# EAGLE design GlobeCopterSensor (EAGLE 8.2.2)
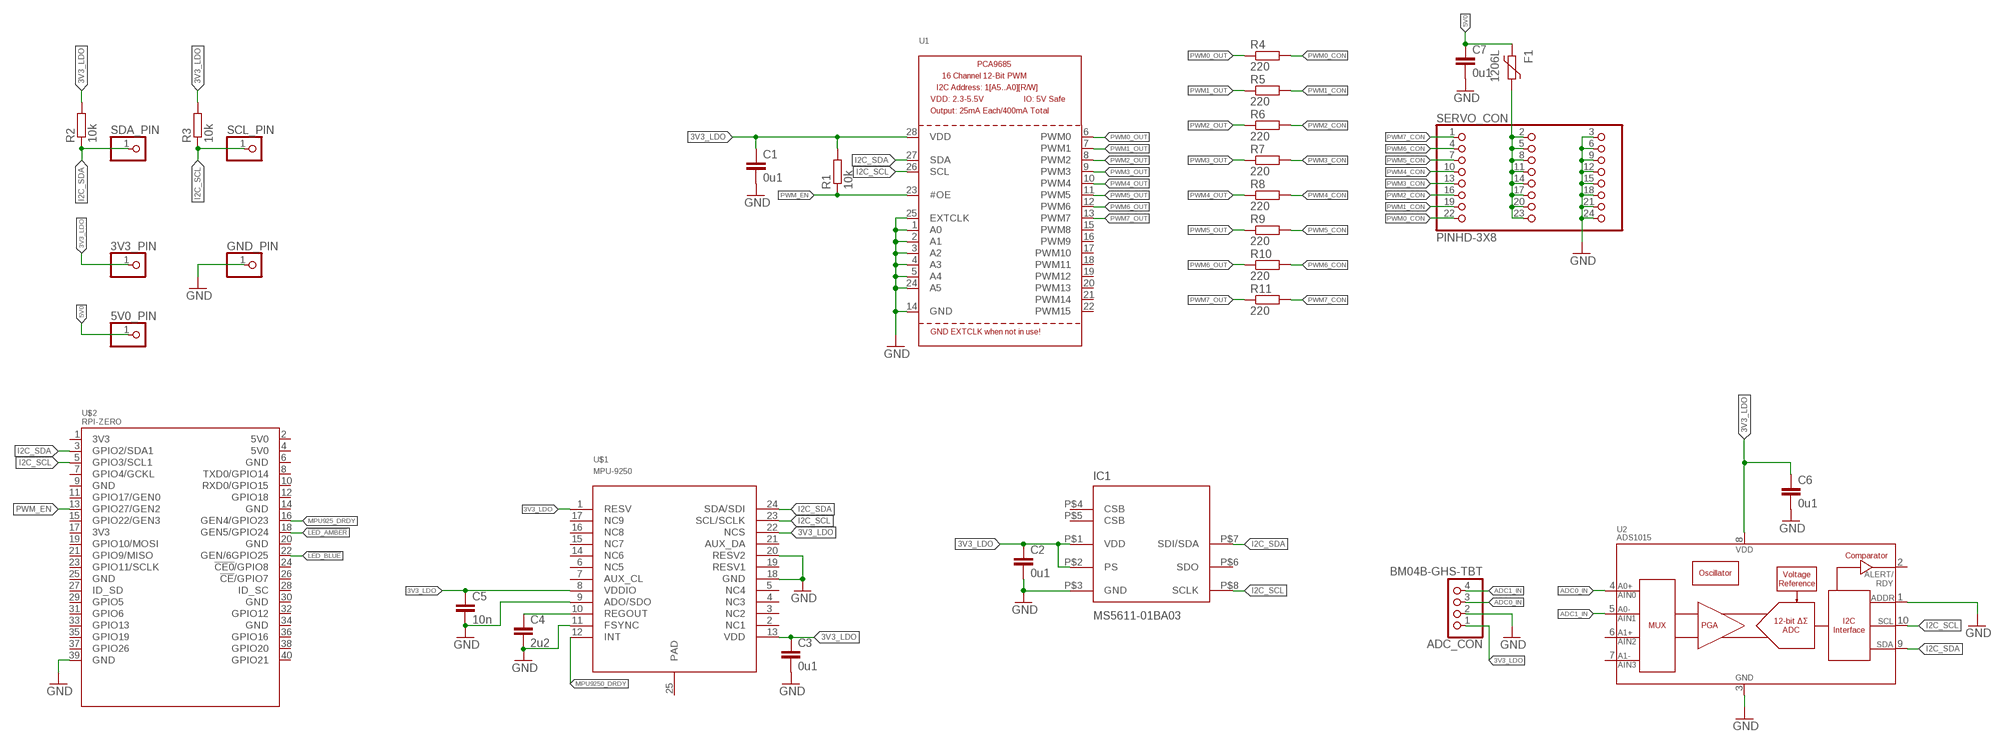
[diagram p0: schematic, sheet 1]

## Parts
3V3_PIN  PINHD-1X1  [1X01]
5V0_PIN  PINHD-1X1  [1X01]
ADC_CON  BM04B-GHS-TBT  [BM04B-GHS-TBT]
C1  0u1  C-EUC0603  [C0603]
C2  0u1  C-EUC0603  [C0603]
C3  0u1  C-EUC0603  [C0603]
C4  2u2  C-EUC0603  [C0603]
C5  10n  C-EUC0603  [C0603]
C6  0u1  C-EUC0603  [C0603]
C7  0u1  C-EUC0603  [C0603]
F1  1206L  [1206L]
GND_PIN  PINHD-1X1  [1X01]
IC1  MS5611-01BA03  [MS5611-01BA03]
R1  10k  R-EU_R0603  [R0603]
R2  10k  R-EU_R0603  [R0603]
R3  10k  R-EU_R0603  [R0603]
R4  220  R-EU_R0603  [R0603]
R5  220  R-EU_R0603  [R0603]
R6  220  R-EU_R0603  [R0603]
R7  220  R-EU_R0603  [R0603]
R8  220  R-EU_R0603  [R0603]
R9  220  R-EU_R0603  [R0603]
R10  220  R-EU_R0603  [R0603]
R11  220  R-EU_R0603  [R0603]
SCL_PIN  PINHD-1X1  [1X01]
SDA_PIN  PINHD-1X1  [1X01]
SERVO_CON  PINHD-3X8  [3X8]
U1  PCA9685  [TSSOP28]
U2  ADS1015  [MSOP10]
U$1  MPU-9250  [LEAD-QFN24]
U$2  RPI-ZERO  [RASPBERRYPI_BASTELSTUBE_V13_RASPI_BOARD_B+_FULL]

## Nets
3V3_LDO: 3V3_PIN.1 ADC_CON.1 C1.1 C2.1 C3.1 C5.1 C6.1 IC1.P$1(VDD) IC1.P$2(PS) R1.2 R2.2 R3.2 U1.28(VDD) U2.8(VDD) U$1.1(RESV) U$1.8(VDDIO) U$1.13(VDD) U$1.22(NCS)
5V0: 5V0_PIN.1 C7.1 F1.P$1
!LED_AMBER!: U$2.18(GEN5/GPIO24)
!LED_BLUE!: U$2.22(GEN/6GPIO25)
ADC0_IN: ADC_CON.3 U2.4(AIN0)
ADC1_IN: ADC_CON.4 U2.5(AIN1)
GND: ADC_CON.2 C1.2 C2.2 C3.2 C4.2 C5.2 C6.2 C7.2 GND_PIN.1 IC1.P$3(GND) SERVO_CON.3 SERVO_CON.6 SERVO_CON.9 SERVO_CON.12 SERVO_CON.15 SERVO_CON.18 SERVO_CON.21 SERVO_CON.24 U1.1(A0) U1.2(A1) U1.3(A2) U1.4(A3) U1.5(A4) U1.14(GND) U1.24(A5) U1.25(EXTCLK) U2.1(ADDR) U2.3(VSS) U$1.9(ADO/SDO) U$1.11(FSYNC) U$1.18(GND) U$1.20(RESV2) U$2.39(GND)
I2C_SCL: IC1.P$8(SCLK) R3.1 SCL_PIN.1 U1.26(SCL) U2.10(SCL) U$1.23(SCL/SCLK) U$2.5(GPIO3/SCL1)
I2C_SDA: IC1.P$7(SDI/SDA) R2.1 SDA_PIN.1 U1.27(SDA) U2.9(SDA) U$1.24(SDA/SDI) U$2.3(GPIO2/SDA1)
MPU925_DRDY: U$2.16(GEN4/GPIO23)
MPU9250_DRDY: U$1.12(INT)
N$2: C4.1 U$1.10(REGOUT)
N$3: F1.P$2 SERVO_CON.2 SERVO_CON.5 SERVO_CON.8 SERVO_CON.11 SERVO_CON.14 SERVO_CON.17 SERVO_CON.20 SERVO_CON.23
PWM0_CON: R4.2 SERVO_CON.22
PWM0_OUT: R4.1 U1.6(PWM0)
PWM1_CON: R5.2 SERVO_CON.19
PWM1_OUT: R5.1 U1.7(PWM1)
PWM2_CON: R6.2 SERVO_CON.16
PWM2_OUT: R6.1 U1.8(PWM2)
PWM3_CON: R7.2 SERVO_CON.13
PWM3_OUT: R7.1 U1.9(PWM3)
PWM4_CON: R8.2 SERVO_CON.10
PWM4_OUT: R8.1 U1.10(PWM4)
PWM5_CON: R9.2 SERVO_CON.7
PWM5_OUT: R9.1 U1.11(PWM5)
PWM6_CON: R10.2 SERVO_CON.4
PWM6_OUT: R10.1 U1.12(PWM6)
PWM7_CON: R11.2 SERVO_CON.1
PWM7_OUT: R11.1 U1.13(PWM7)
PWM_EN: R1.1 U1.23(#OE) U$2.13(GPIO27/GEN2)
Unconnected: IC1.P$4(CSB) IC1.P$5(CSB) IC1.P$6(SDO) U1.15(PWM8) U1.16(PWM9) U1.17(PWM10) U1.18(PWM11) U1.19(PWM12) U1.20(PWM13) U1.21(PWM14) U1.22(PWM15) U2.2(ALERT/RDY) U2.6(AIN2) U2.7(AIN3) U$1.2(NC1) U$1.3(NC2) U$1.4(NC3) U$1.5(NC4) U$1.6(NC5) U$1.7(AUX_CL) U$1.14(NC6) U$1.15(NC7) U$1.16(NC8) U$1.17(NC9) U$1.19(RESV1) U$1.21(AUX_DA) U$1.25(PAD) U$2.1(3V3) U$2.2(5V0) U$2.4(5V0) U$2.6(GND) U$2.7(GPIO4/GCKL) U$2.8(TXD0/GPIO14) U$2.9(GND) U$2.10(RXD0/GPIO15) U$2.11(GPIO17/GEN0) U$2.12(GPIO18) U$2.14(GND) U$2.15(GPIO22/GEN3) U$2.17(3V3) U$2.19(GPIO10/MOSI) U$2.20(GND) U$2.21(GPIO9/MISO) U$2.23(GPIO11/SCLK) U$2.24(!CE0!/GPIO8) U$2.25(GND) U$2.26(!CE!/GPIO7) U$2.27(ID_SD) U$2.28(ID_SC) U$2.29(GPIO5) U$2.30(GND) U$2.31(GPIO6) U$2.32(GPIO12) U$2.33(GPIO13) U$2.34(GND) U$2.35(GPIO19) U$2.36(GPIO16) U$2.37(GPIO26) U$2.38(GPIO20) U$2.40(GPIO21)

## Library data of the parts
3V3_PIN 5V0_PIN GND_PIN SCL_PIN SDA_PIN = pinhead:PINHD-1X1: PIN HEADER
ADC_CON = connector:BM04B-GHS-TBT
C1-C7 = resistor:C-EU: CAPACITOR, European symbol
F1 = ptc-littlefuse:1206L
IC1 = Measurement-Specialties:MS5611-01BA03: Variometer Module, with stainless steel cap
R1-R11 = resistor:R-EU_: RESISTOR, European symbol
SERVO_CON = pinhead:PINHD-3X8
U1 = adafruit:PCA9685: PCA9685 - 16 Channel 12-Bit I2C PWM Controller 5.0V tolerant 16 channel, 12-bit I2C PWM controller with 25mA per output (max. 400mA total) Digikey: 568-5931-1-ND
U2 = SparkFun-AnalogIC:ADS1015: 12-Bit Del-Sig ADC Four single-ended inputs or two differential inputs Internal PGA I2C interface 2.0-5.5V; PROD_ID: IC-12239
U$1 = invensense:MPU-9250
U$2 = RPI-Zero:RPI-ZERO

## Board
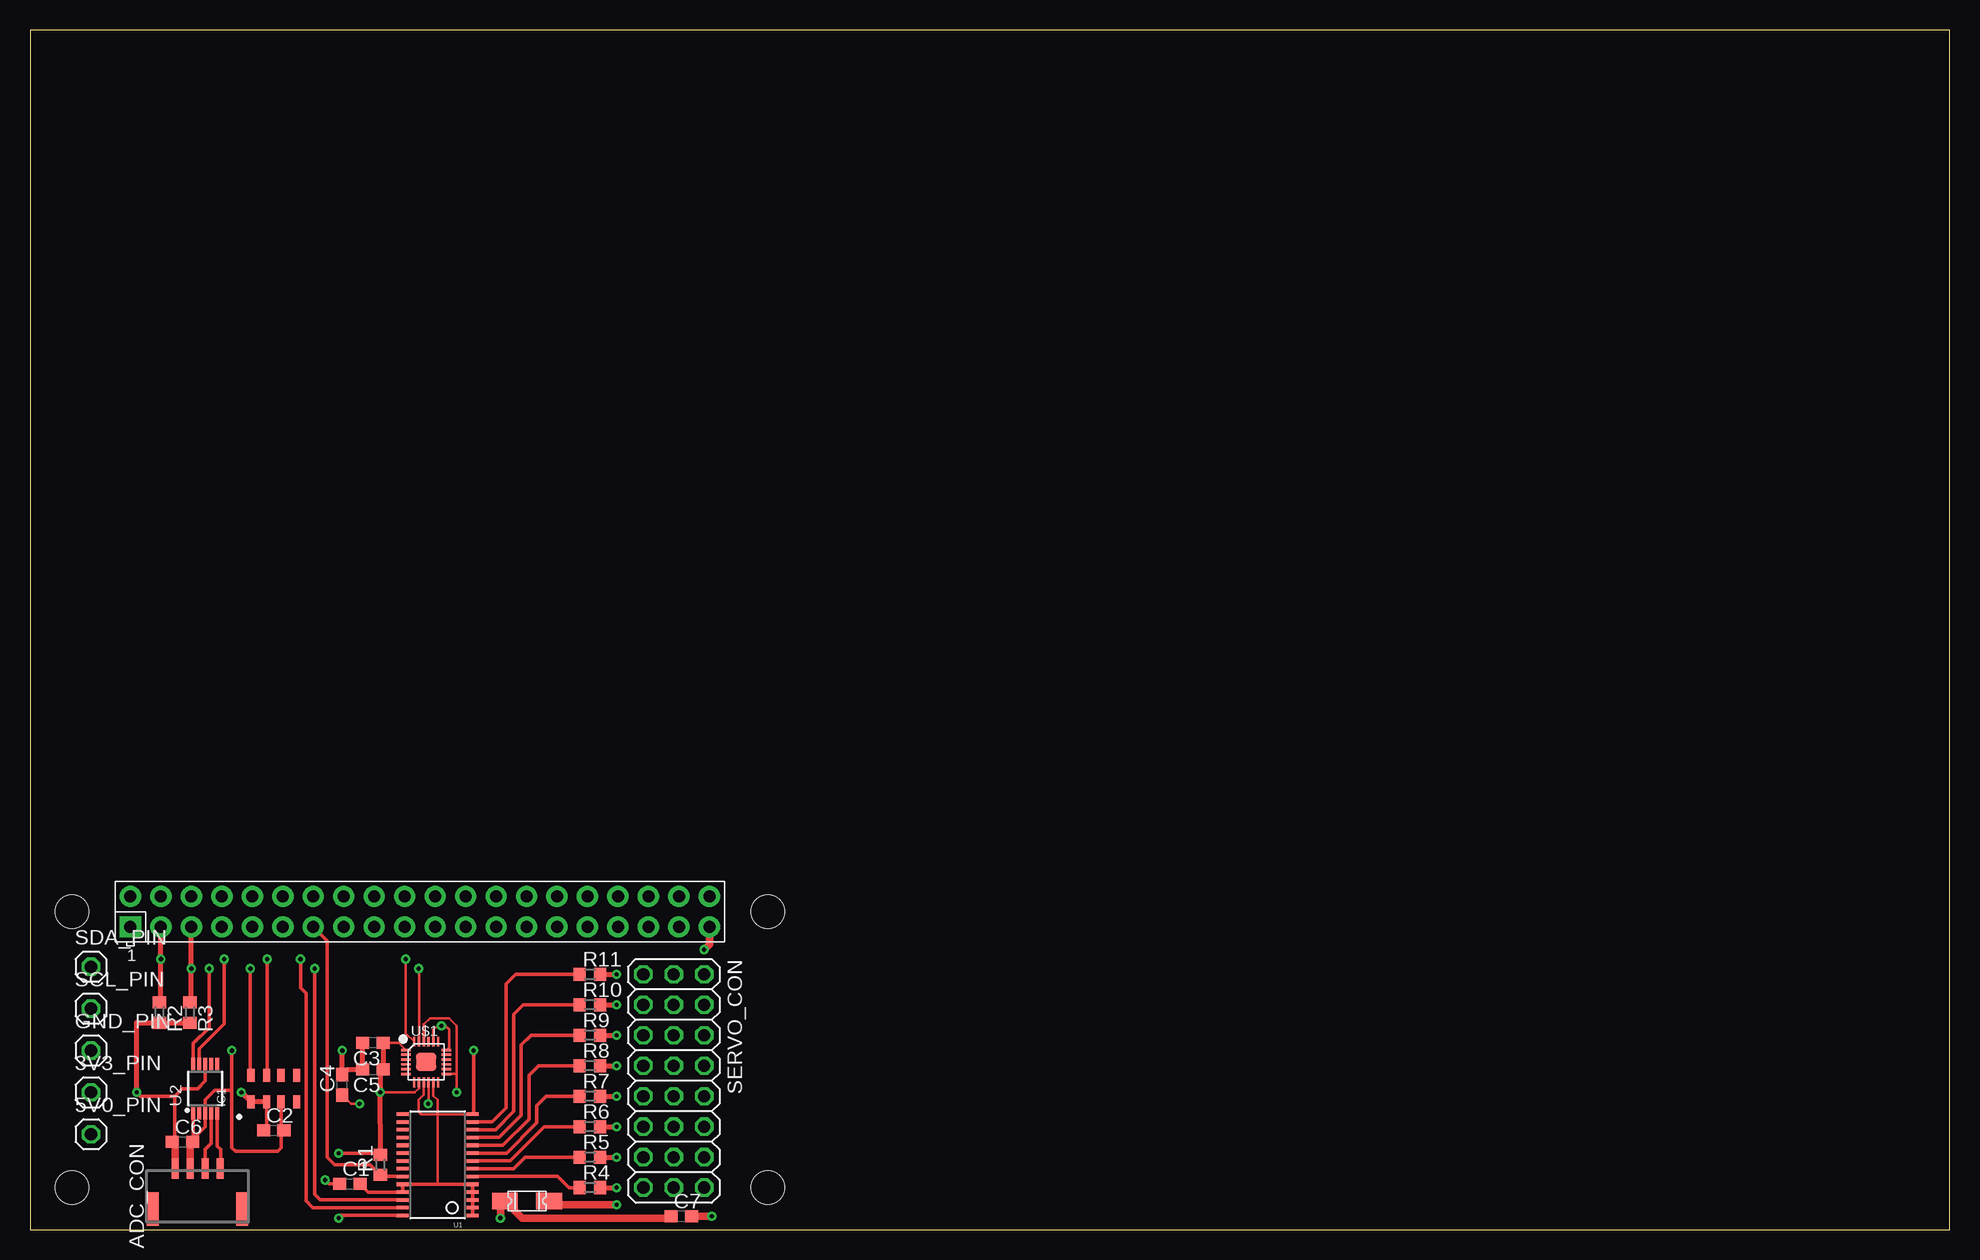
[diagram p1: board, top side]
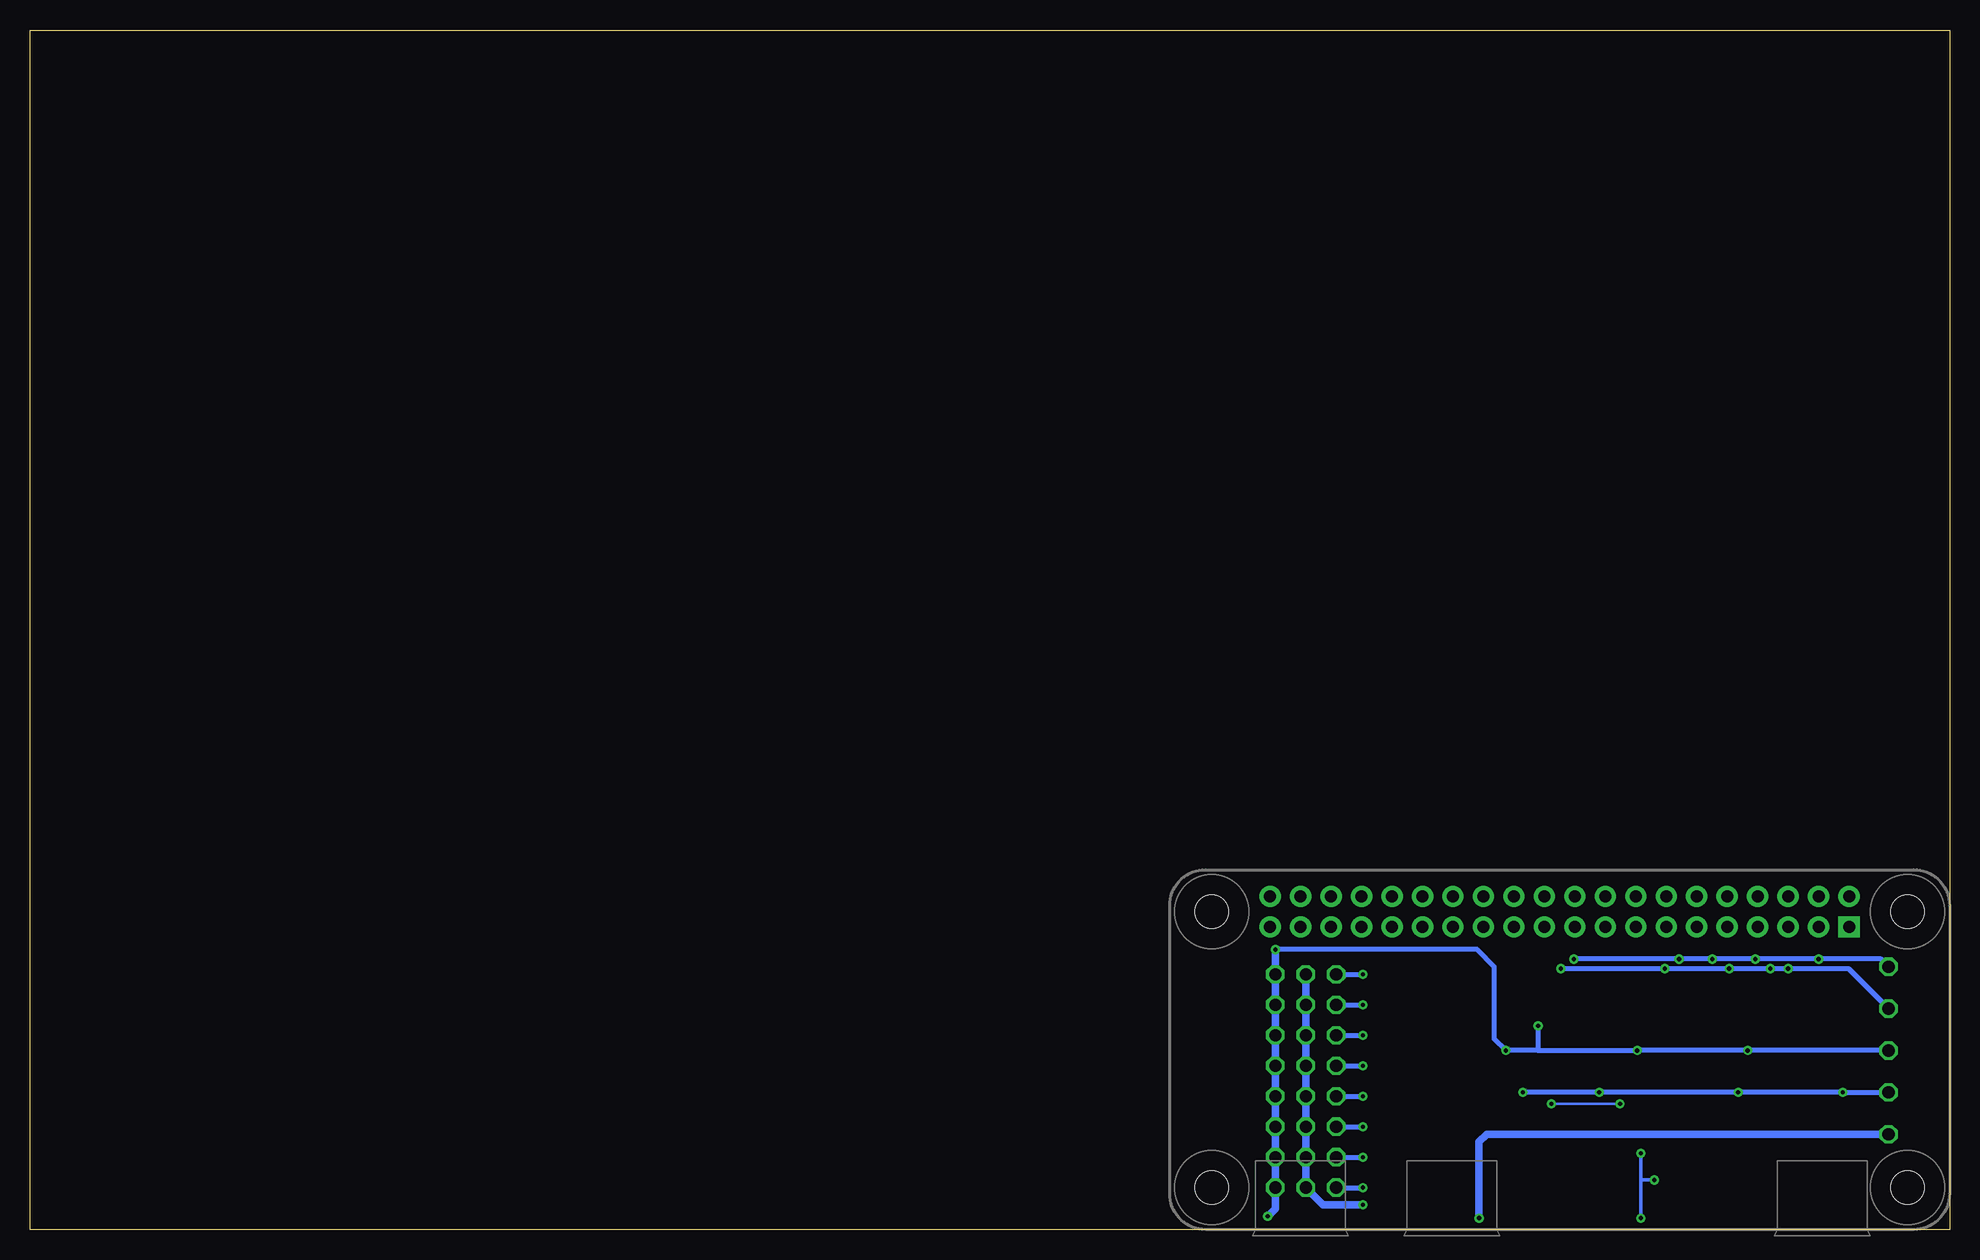
[diagram p2: board, bottom side, seen from below]

Size 160 x 100 mm. Coordinates in mm from the lower left corner, seen from the top.
Outline: 0,0 160,0 160,100 0,100 0,0
Copper layers (1*16): Top 0.035mm / dielectric 1.5mm / Bottom 0.035mm
Design rules "default": minimum track width 6mil, minimum drill 0.35mm, track to track 6mil, track to pad 6mil, pad to pad 6mil, via to via 6mil, smd to smd 6mil, copper to edge 40mil, drill to drill 6mil, minimum pad ring 10mil, minimum via ring 8mil, stop-mask expansion 4mil, vias tented up to drill 0mil, thermal gap 10mil

### Footprints (pad centres in the part's own frame; a part is rotated, then mirrored left to right if it is on the bottom)
1X01 = drill 1.016 octagon: 1 0,0
BM04B-GHS-TBT = smd 0.6 x 1.7: 1 -1.875,2.21; 2 -0.625,2.21; 3 0.625,2.21; 4 1.875,2.21 | smd 1 x 2.8: FIT@1 -3.725,-1.14; FIT@2 3.725,-1.14
C0603 = smd 1.1 x 1: 1 -0.85,0; 2 0.85,0
1206L = smd 2.16 x 1.4: P$1 -1.85,0; P$2 1.85,0
MS5611-01BA03 = smd 1.1 x 0.6: P$1 -1.1,1.9; P$2 -1.1,0.6; P$3 -1.11,-0.6; P$4 -1.1,-1.9; P$5 1.1,-1.9; P$6 1.1,-0.6; P$7 1.1,0.6; P$8 1.1,1.9
R0603 = smd 1 x 1.1: 1 -0.85,0; 2 0.85,0
3X8 = drill 1.016 octagon: 1 -8.89,0; 2 -8.89,2.54; 3 -8.89,5.08; 4 -6.35,0; 5 -6.35,2.54; 6 -6.35,5.08; 7 -3.81,0; 8 -3.81,2.54; 9 -3.81,5.08; 10 -1.27,0; 11 -1.27,2.54; 12 -1.27,5.08; 13 1.27,0; 14 1.27,2.54; 15 1.27,5.08; 16 3.81,0; 17 3.81,2.54; 18 3.81,5.08; 19 6.35,0; 20 6.35,2.54; 21 6.35,5.08; 22 8.89,0; 23 8.89,2.54; 24 8.89,5.08
TSSOP28 = smd 0.305 x 0.991: 1 -4.225,-2.918; 2 -3.575,-2.918; 3 -2.925,-2.918; 4 -2.275,-2.918; 5 -1.625,-2.918; 6 -0.975,-2.918; 7 -0.325,-2.918; 8 0.325,-2.918; 9 0.975,-2.918; 10 1.625,-2.918; 11 2.275,-2.918; 12 2.925,-2.918; 13 3.575,-2.918; 14 4.225,-2.918; 15 4.225,2.918; 16 3.575,2.918; 17 2.925,2.918; 18 2.275,2.918; 19 1.625,2.918; 20 0.975,2.918; 21 0.325,2.918; 22 -0.325,2.918; 23 -0.975,2.918; 24 -1.625,2.918; 25 -2.275,2.918; 26 -2.925,2.918; 27 -3.575,2.918; 28 -4.225,2.918
MSOP10 = smd 0.3 x 1: 1 -1,-2.05; 2 -0.5,-2.05; 3 0,-2.05; 4 0.5,-2.05; 5 1,-2.05; 6 1,2.05; 7 0.5,2.05; 8 0,2.05; 9 -0.5,2.05; 10 -1,2.05
LEAD-QFN24 = smd 0.8 x 0.2: 1 -1.7,1; 2 -1.7,0.6; 3 -1.7,0.2; 4 -1.7,-0.2; 5 -1.7,-0.6; 6 -1.7,-1; 13 1.7,-1; 14 1.7,-0.6; 15 1.7,-0.2; 16 1.7,0.2; 17 1.7,0.6; 18 1.7,1 | smd 0.2 x 0.8: 7 -1,-1.7; 8 -0.6,-1.7; 9 -0.2,-1.7; 10 0.2,-1.7; 11 0.6,-1.7; 12 1,-1.7; 19 1,1.7; 20 0.6,1.7; 21 0.2,1.7; 22 -0.2,1.7; 23 -0.6,1.7; 24 -1,1.7 | smd 1.7 x 1.54: 25 0,0
RASPBERRYPI_BASTELSTUBE_V13_RASPI_BOARD_B+_FULL = drill 1 pad 1.778 square: 1 8.37,25.23 | drill 1 pad 1.778: 2 8.37,27.77; 3 10.91,25.23; 4 10.91,27.77; 5 13.45,25.23; 6 13.45,27.77; 7 15.99,25.23; 8 15.99,27.77; 9 18.53,25.23; 10 18.53,27.77; 11 21.07,25.23; 12 21.07,27.77; 13 23.61,25.23; 14 23.61,27.77; 15 26.15,25.23; 16 26.15,27.77; 17 28.69,25.23; 18 28.69,27.77; 19 31.23,25.23; 20 31.23,27.77; 21 33.77,25.23; 22 33.77,27.77; 23 36.31,25.23; 24 36.31,27.77; 25 38.85,25.23; 26 38.85,27.77; 27 41.39,25.23; 28 41.39,27.77; 29 43.93,25.23; 30 43.93,27.77; 31 46.47,25.23; 32 46.47,27.77; 33 49.01,25.23; 34 49.01,27.77; 35 51.55,25.23; 36 51.55,27.77; 37 54.09,25.23; 38 54.09,27.77; 39 56.63,25.23; 40 56.63,27.77 | hole 2.75: 3.5,3.5; 3.5,26.5; 61.5,3.5; 61.5,26.5

### Placement (x,y rotation side)
3V3_PIN  5.08,11.43 0 top
5V0_PIN  5.08,7.94 0 top
ADC_CON  13.97,2.86 0 top
C1  26.67,3.81 0 top
C2  20.32,8.26 0 top
C3  28.57,15.56 180 top
C4  26.04,12.06 90 top
C5  28.57,13.34 180 top
C6  12.7,7.3 0 top
C7  54.29,1.11 0 top
F1  41.43,2.38 0 top
GND_PIN  5.08,14.92 0 top
IC1  20.32,11.75 90 top
R1  29.21,5.4 90 top
R2  10.79,18.1 270 top
R3  13.34,18.1 270 top
R4  46.67,3.49 0 top
R5  46.67,6.03 0 top
R6  46.67,8.57 0 top
R7  46.67,11.11 0 top
R8  46.67,13.65 0 top
R9  46.67,16.19 0 top
R10  46.67,18.73 0 top
R11  46.67,21.27 0 top
SCL_PIN  5.08,18.41 0 top
SDA_PIN  5.08,21.91 0 top
SERVO_CON  51.12,12.38 270 top
U1  33.97,5.4 90 top
U2  14.61,11.75 0 top
U$1  33.02,13.97 0 top
U$2  0,0 0 top

### Tracks (layer width: path | path; a pad name or v marks a point on that pad's centre or on a via)
3V3_LDO  (via drill 0.35)
  Top 0.203: U$1.22 32.82,17.1 33.34,17.62 34.92,17.62 35.56,16.99 35.56,12.96 | U$1.8 32.42,11.78 32.07,11.43 v29.2,11.43 | U$1.1 30.73,15.56 C3.1 | 35.56,12.96 35.55,12.97 U$1.13 | 35.56,12.96 v35.56,11.43
  Top 0.305: U2.8 14.61,12.38 13.97,11.75 12.7,11.75 12.06,11.11 | 12.06,11.11 12.06,7.52 C6.1 | v8.89,11.43 9.21,11.11 12.06,11.11 | IC1.P$2 19.72,8.26 C2.1 | 29.21,13.12 C5.1 | U1.28 25.94,1.17 v25.72,0.95 | v25.72,6.35 29.11,6.35 R1.2 | C1.1 24.92,3.81 v24.61,4.13
  Top 0.406: C3.1 C5.1 29.2,13.11 v29.2,11.43 R1.2 | v8.89,11.43 8.89,17.23 8.91,17.25 R2.2 R3.2 | IC1.P$2 IC1.P$1 | IC1.P$1 18.42,10.79 | IC1.P$1 17.64,11.43 v17.62,11.43
  Top 0.61: C6.1 12.1,7.06 ADC_CON.1
  Bottom 0.305: 25.72,4.17 v25.72,0.95 | 25.72,4.17 v25.72,6.35 | v24.61,4.13 25.68,4.13 25.72,4.17
  Bottom 0.406: 3V3_PIN.1 v8.89,11.43 v17.62,11.43 v29.2,11.43 v35.56,11.43
5V0  (via drill 0.35)
  Top 0.61: C7.1 53.28,0.95 41.01,0.95 F1.P$1 39.21,2.01 v39.21,0.95
  Bottom 0.61: 5V0_PIN.1 38.58,7.94 39.21,7.3 v39.21,0.95
ADC0_IN
  Top 0.305: U2.4 15.11,7.17 14.61,6.67 ADC_CON.3
ADC1_IN
  Top 0.305: U2.5 15.61,6.94 15.88,6.67 15.88,5.1 ADC_CON.4
GND  (via drill 0.35)
  Top 0.203: U$1.20 33.62,16.63 33.97,16.99 v34.29,16.99 34.61,16.99 34.92,16.67 34.92,15.18 U$1.18 | U$1.11 33.62,11.15 33.97,10.79 33.97,9.61 | 33.97,9.61 33.97,3.85 33.9,3.77 | U$1.9 32.82,11.23 32.38,10.79 32.38,9.84 32.61,9.61 33.97,9.61 | U1.14 arc-90 U1.14 33.97,9.61
  Top 0.305: U2.1 13.61,7.36 C6.2 13.55,7.52 14.61,8.57 U2.3 14.61,10.79 15.42,11.61 16.83,11.61 | U1.1 U1.2 U1.3 U1.4 U1.5 33.9,3.77 U1.24 U1.25 28.21,3.12 C1.2 | IC1.P$3 20.92,8.26 C2.2 20.95,8.04 20.95,6.83 20.64,6.51 17.14,6.51 16.83,6.83 16.83,11.61 | 16.83,11.61 v16.83,14.92 | U1.14 36.99,9.72 v36.99,14.92
  Top 0.406: C3.2 C5.2 26.45,13.34 C4.2 v26.04,14.92
  Top 0.61: C6.2 13.35,7.1 ADC_CON.2 | v56.2,23.34 56.63,23.77 U$2.39 | C7.2 v56.83,1.11
  Bottom 0.406: GND_PIN.1 v16.83,14.92 v26.04,14.92 34.29,14.92 | v34.29,16.99 34.29,14.92 | 34.29,14.92 v36.99,14.92 37.94,15.88 37.94,21.91 39.37,23.34 v56.2,23.34
  Bottom 0.61: v56.2,23.34 SERVO_CON.3 SERVO_CON.6 SERVO_CON.9 SERVO_CON.12 SERVO_CON.15 SERVO_CON.18 SERVO_CON.21 SERVO_CON.24 56.2,1.75 v56.83,1.11
I2C_SCL  (via drill 0.35)
  Top 0.203: U$1.23 32.42,21.71 v32.38,21.75
  Top 0.305: U2.10 13.61,15.51 14.92,16.83 14.92,21.59 14.94,21.61 v14.94,21.75 | U1.26 24.2,2.47 23.74,2.93 v23.74,21.75 | IC1.P$8 18.37,12.9 v18.37,21.75
  Top 0.406: v13.45,21.75 U$2.5 | v13.45,21.75 | R3.1 13.45,19.06 v13.45,21.75
  Bottom 0.406: SCL_PIN.1 8.41,21.75 v13.45,21.75 v14.94,21.75 v18.37,21.75 v23.74,21.75 v32.38,21.75
I2C_SDA  (via drill 0.35)
  Top 0.203: U$1.24 31.32,16.37 v31.32,22.54
  Top 0.305: U2.9 14.11,15.06 16.19,17.14 v16.19,22.54 | U1.27 23.58,1.82 23.02,2.38 23.02,19.68 22.54,20.16 v22.54,22.54 | IC1.P$7 19.77,12.9 v19.77,22.54
  Top 0.406: v10.91,22.54 U$2.3 | v10.91,22.54 | R2.1 10.91,19.06 v10.91,22.54
  Bottom 0.406: SDA_PIN.1 5.71,22.54 v10.91,22.54 v16.19,22.54 v19.77,22.54 v22.54,22.54 v31.32,22.54
N$2  (via drill 0.35)
  Top 0.203: U$1.10 33.22,10.48 v33.18,10.48 | C4.1 26.77,10.48 v27.46,10.48
  Bottom 0.203: v33.18,10.48 v27.46,10.48
N$3  (via drill 0.35)
  Top 0.61: v48.9,2.06 43.6,2.06 F1.P$2
  Bottom 0.61: SERVO_CON.2 SERVO_CON.5 SERVO_CON.8 SERVO_CON.11 SERVO_CON.14 SERVO_CON.17 SERVO_CON.20 SERVO_CON.23 52.23,2.06 v48.9,2.06
PWM0_CON  (via drill 0.35)
  Top 0.406: R4.2 v48.9,3.49
  Bottom 0.406: SERVO_CON.22 v48.9,3.49
PWM0_OUT
  Top 0.305: U1.6 44,4.42 44.93,3.49 R4.1
PWM1_CON  (via drill 0.35)
  Top 0.406: R5.2 v48.9,6.03
  Bottom 0.406: SERVO_CON.19 v48.9,6.03
PWM1_OUT
  Top 0.305: U1.7 40.31,5.07 41.27,6.03 R5.1
PWM2_CON  (via drill 0.35)
  Top 0.406: R6.2 v48.9,8.57
  Bottom 0.406: SERVO_CON.16 v48.9,8.57
PWM2_OUT
  Top 0.305: U1.8 40.01,5.72 42.86,8.57 R6.1
PWM3_CON  (via drill 0.35)
  Top 0.406: R7.2 v48.9,11.11
  Bottom 0.406: SERVO_CON.13 v48.9,11.11
PWM3_OUT
  Top 0.305: U1.9 39.71,6.37 42.23,8.89 42.23,10.32 43.02,11.11 R7.1
PWM4_CON  (via drill 0.35)
  Top 0.406: R8.2 v48.9,13.65
  Bottom 0.406: SERVO_CON.10 v48.9,13.65
PWM4_OUT
  Top 0.305: U1.10 39.41,7.02 41.59,9.21 41.59,12.86 42.39,13.65 R8.1
PWM5_CON  (via drill 0.35)
  Top 0.406: R9.2 v48.9,16.19
  Bottom 0.406: SERVO_CON.7 v48.9,16.19
PWM5_OUT
  Top 0.305: U1.11 39.1,7.67 40.96,9.53 40.96,15.4 41.75,16.19 R9.1
PWM6_CON  (via drill 0.35)
  Top 0.406: R10.2 v48.9,18.73
  Bottom 0.406: SERVO_CON.4 v48.9,18.73
PWM6_OUT
  Top 0.305: U1.12 38.8,8.32 40.32,9.84 40.32,17.94 41.12,18.73 R10.1
PWM7_CON  (via drill 0.35)
  Top 0.406: R11.2 v48.9,21.27
  Bottom 0.406: SERVO_CON.1 v48.9,21.27
PWM7_OUT
  Top 0.305: U1.13 38.5,8.97 39.69,10.16 39.69,20.48 40.48,21.27 R11.1
PWM_EN
  Top 0.305: U$2.13 24.77,24.07 24.77,6.03 25.4,5.4 28.36,5.4 R1.1 29.34,4.42 U1.23